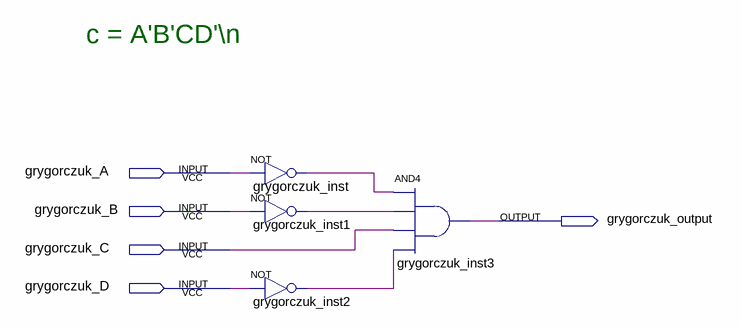
[diagram p0: schematic sheet]
// Quartus schematic SEVEN_SEGMENT_DISPLAY_NORMAL_C.bdf as structural Verilog: 4 symbols, 5 pins
module SEVEN_SEGMENT_DISPLAY_NORMAL_C (
  input  grygorczuk_A,
  input  grygorczuk_B,
  input  grygorczuk_C,
  input  grygorczuk_D,
  output grygorczuk_output
);

  wire grygorczuk_inst1_out, grygorczuk_inst2_out, grygorczuk_inst_out;

  not grygorczuk_inst (grygorczuk_inst_out, grygorczuk_A);
  not grygorczuk_inst1 (grygorczuk_inst1_out, grygorczuk_B);
  not grygorczuk_inst2 (grygorczuk_inst2_out, grygorczuk_D);
  and grygorczuk_inst3 (grygorczuk_output, grygorczuk_inst_out, grygorczuk_inst1_out, grygorczuk_C, grygorczuk_inst2_out);

  // Notes on the sheet:
  //   c = A'B'CD'\n
endmodule
